# Altium project EL.UPSM.T01.PrjPcb
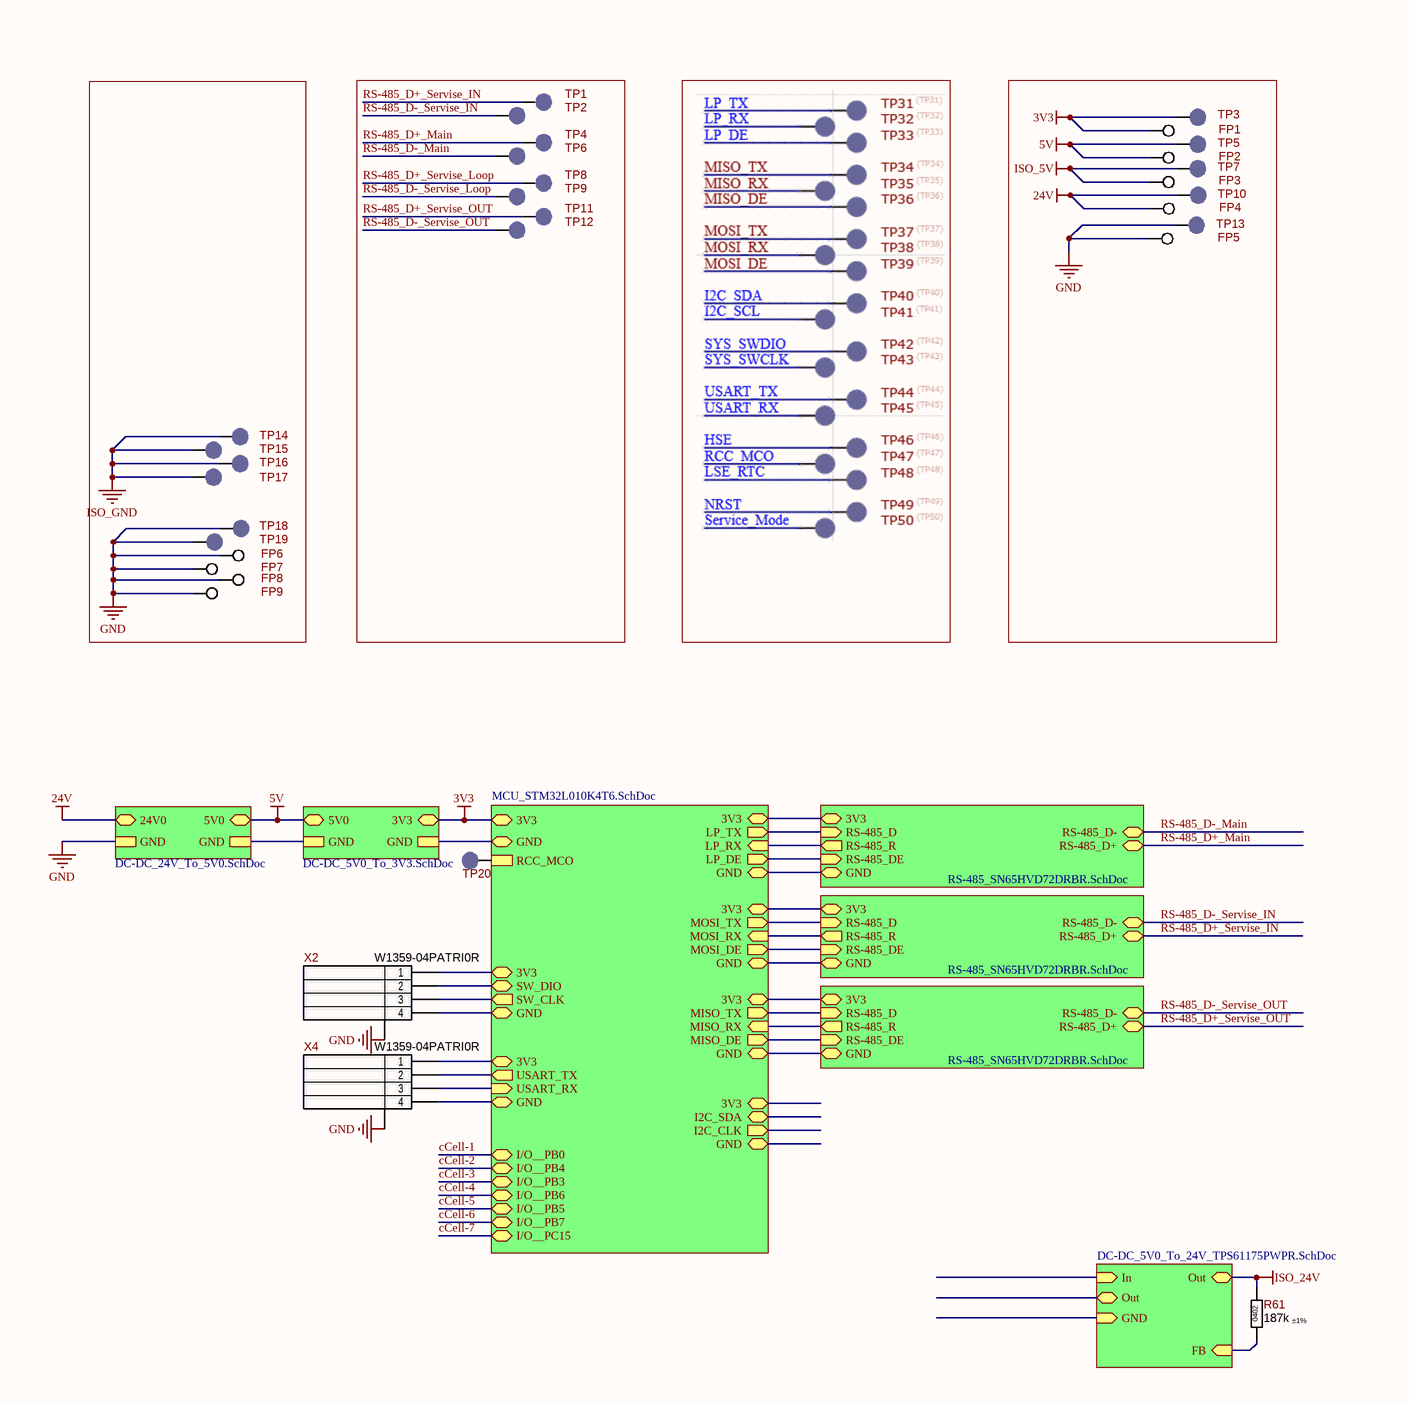
[diagram p0: UPS_Module.SchDoc, left]
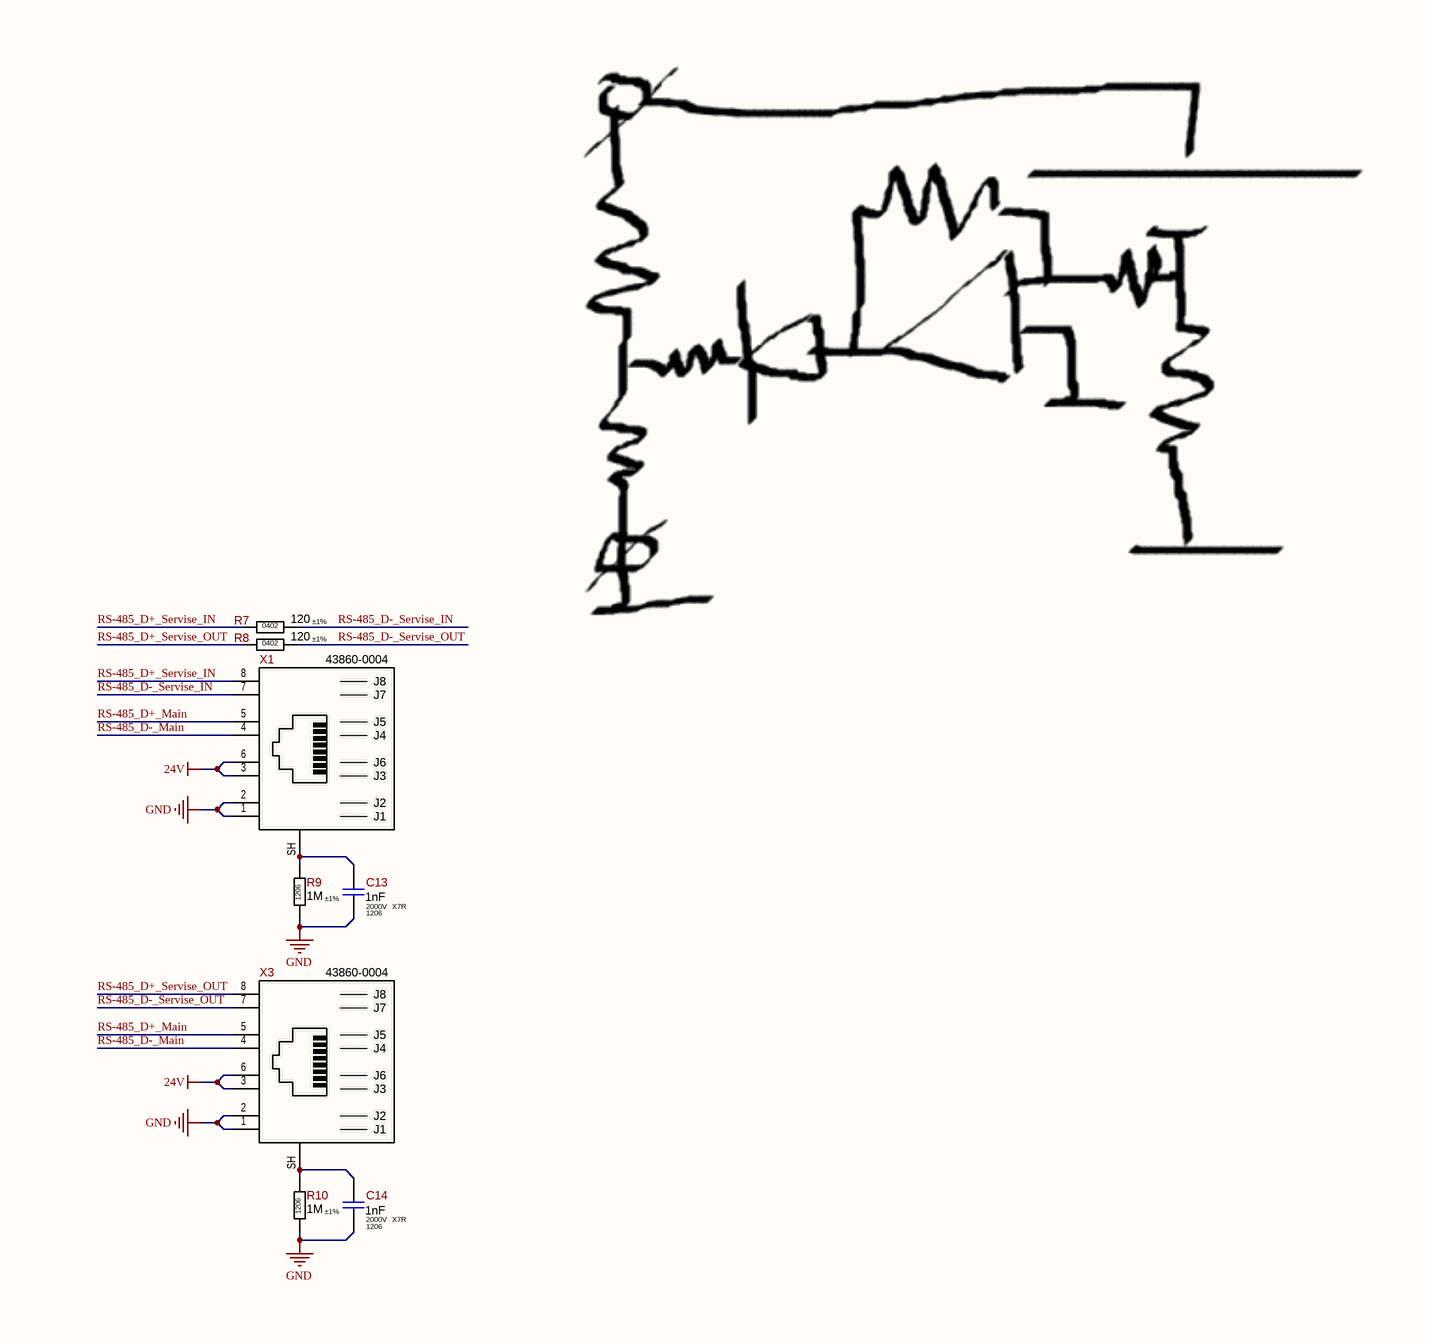
[diagram p1: UPS_Module.SchDoc, right]
1 sheet, 40 parts. Net scope: hierarchical (ports join the sheet entries above them; power ports are global).
Board file: UPS_Module.PcbDoc

## Sheet UPS_Module.SchDoc
size A3; SheetNumber: 11; SheetTotal: 15

### Parts
C13  Package: 1206  Voltage: 2000V  Dielectric Type: X7R  [CAP-1206(3216)X125T20]  (hidden comment: 1nF)
C14  Package: 1206  Voltage: 2000V  Dielectric Type: X7R  [CAP-1206(3216)X125T20]  (hidden comment: 1nF)
FP1  PAD-1.1mm  [PAD-1.1mm]  (value not drawn)  (no BOM)
FP2  PAD-1.1mm  [PAD-1.1mm]  (value not drawn)  (no BOM)
FP3  PAD-1.1mm  [PAD-1.1mm]  (value not drawn)  (no BOM)
FP4  PAD-1.1mm  [PAD-1.1mm]  (value not drawn)  (no BOM)
FP5  PAD-1.1mm  [PAD-1.1mm]  (value not drawn)  (no BOM)
FP6  PAD-1.1mm  [PAD-1.1mm]  (value not drawn)  (no BOM)
FP7  PAD-1.1mm  [PAD-1.1mm]  (value not drawn)  (no BOM)
FP8  PAD-1.1mm  [PAD-1.1mm]  (value not drawn)  (no BOM)
FP9  PAD-1.1mm  [PAD-1.1mm]  (value not drawn)  (no BOM)
R7  Tolerance: ±1%  Package: 0402  [R_ANY_CHIP_0402_HI]  (hidden comment: 120)
R8  Tolerance: ±1%  Package: 0402  [R_ANY_CHIP_0402_HI]  (hidden comment: 120)
R9  Tolerance: ±1%  Package: 1206  [CHV1206-Series]  (hidden comment: 1M)
R10  Tolerance: ±1%  Package: 1206  [CHV1206-Series]  (hidden comment: 1M)
R61  Tolerance: ±1%  Package: 0402  [R_ANY_CHIP_0402_MED]  (hidden comment: 187k)
TP1  LED_LINK  [TP_SMD_2mm]  (value not drawn)  (no BOM)
TP2  LED_LINK  [TP_SMD_2mm]  (value not drawn)  (no BOM)
TP3  LED_LINK  [TP_SMD_2mm]  (value not drawn)  (no BOM)
TP4  LED_LINK  [TP_SMD_2mm]  (value not drawn)  (no BOM)
TP5  LED_LINK  [TP_SMD_2mm]  (value not drawn)  (no BOM)
TP6  LED_LINK  [TP_SMD_2mm]  (value not drawn)  (no BOM)
TP7  LED_LINK  [TP_SMD_2mm]  (value not drawn)  (no BOM)
TP8  LED_LINK  [TP_SMD_2mm]  (value not drawn)  (no BOM)
TP9  LED_LINK  [TP_SMD_2mm]  (value not drawn)  (no BOM)
TP10  LED_LINK  [TP_SMD_2mm]  (value not drawn)  (no BOM)
TP11  LED_LINK  [TP_SMD_2mm]  (value not drawn)  (no BOM)
TP12  LED_LINK  [TP_SMD_2mm]  (value not drawn)  (no BOM)
TP13  LED_LINK  [TP_SMD_2mm]  (value not drawn)  (no BOM)
TP14  LED_LINK  [TP_SMD_2mm]  (value not drawn)  (no BOM)
TP15  LED_LINK  [TP_SMD_2mm]  (value not drawn)  (no BOM)
TP16  LED_LINK  [TP_SMD_2mm]  (value not drawn)  (no BOM)
TP17  LED_LINK  [TP_SMD_2mm]  (value not drawn)  (no BOM)
TP18  LED_LINK  [TP_SMD_2mm]  (value not drawn)  (no BOM)
TP19  LED_LINK  [TP_SMD_2mm]  (value not drawn)  (no BOM)
TP20  LED_LINK  [TP_SMD_2mm]  (value not drawn)  (no BOM)
X1  43860-0004  [43860-0004]
X2  W1359-04PATRI0R  [W1359-04PATXI0R_DBG]
X3  43860-0004  [43860-0004]
X4  W1359-04PATRI0R  [W1359-04PATXI0R_DBG]

### Sub-sheets
ISO_I2C = DC-DC_5V0_To_24V_TPS61175PWPR.SchDoc (file not in this document): Out (bidir), In (in), GND (in), Out (bidir), FB (in)
LDO_3V3 = DC-DC_5V0_To_3V3.SchDoc (file not in this document): 3V3 (bidir), 5V0 (bidir), GND, GND
LDO_3V3 = DC-DC_24V_To_5V0.SchDoc (file not in this document): 5V0 (bidir), 24V0 (bidir), GND, GND
MCU = MCU_STM32L010K4T6.SchDoc (file not in this document): LP_TX (out), LP_RX (in), LP_DE (out), MISO_TX (out), MISO_RX (in), MISO_DE (out), MOSI_RX (in), MOSI_TX (out), MOSI_DE (out), I2C_SDA (bidir), I2C_CLK (out), SW_DIO (bidir), SW_CLK (out), USART_TX (out), USART_RX (in), RCC_MCO, I/O__PB0 (bidir), I/O__PB3 (bidir), I/O__PB4 (bidir), I/O__PB5 (bidir), I/O__PB6 (bidir), I/O__PB7 (bidir), I/O__PC15 (bidir), 3V3 (bidir), 3V3 (bidir), 3V3 (bidir), 3V3 (bidir), 3V3 (bidir), GND (bidir), GND (bidir), GND (bidir), GND (bidir), GND (bidir), GND (bidir), GND (bidir), 3V3 (bidir), 3V3 (bidir)
RS-485 = RS-485_SN65HVD72DRBR.SchDoc (file not in this document): 3V3 (bidir), RS-485_D+ (bidir), RS-485_D- (bidir), RS-485_R (out), RS-485_D (in), RS-485_DE (in), GND (bidir)
RS-485 = RS-485_SN65HVD72DRBR.SchDoc (file not in this document): 3V3 (bidir), RS-485_D+ (bidir), RS-485_D- (bidir), RS-485_R (out), RS-485_D (in), RS-485_DE (in), GND (bidir)
RS-485 = RS-485_SN65HVD72DRBR.SchDoc (file not in this document): 3V3 (bidir), RS-485_D+ (bidir), RS-485_D- (bidir), RS-485_R (out), RS-485_D (in), RS-485_DE (in), GND (bidir)

### Nets
3V3: FP1.1 TP3.1 ; sheet LDO_3V3/3V3, sheet MCU/3V3
5V: FP2.1 TP5.1 ; sheet LDO_3V3/5V0, sheet LDO_3V3/5V0
24V: FP4.1 TP10.1 X1.3(TD3-) X1.6(CT) X3.3(TD3-) X3.6(CT) ; sheet LDO_3V3/24V0
GND: C13.2 C14.2 FP5.1 FP6.1 FP7.1 FP8.1 FP9.1 R9.2 R10.2 TP13.1 TP18.1 TP19.1 X1.1(TD4-) X1.2(TD4+) X2.MP(MountPad) X3.1(TD4-) X3.2(TD4+) X4.MP(MountPad) ; sheet LDO_3V3/GND
ISO_5V: FP3.1 TP7.1
ISO_24V: R61.1 ; sheet ISO_I2C/Out
ISO_GND: TP14.1 TP15.1 TP16.1 TP17.1
cCell-1: sheet MCU/I/O__PB0
cCell-2: sheet MCU/I/O__PB4
cCell-3: sheet MCU/I/O__PB3
cCell-4: sheet MCU/I/O__PB6
cCell-5: sheet MCU/I/O__PB5
cCell-6: sheet MCU/I/O__PB7
cCell-7: sheet MCU/I/O__PC15
RS-485_D+_Main: TP4.1 X1.5(CT) X3.5(CT) ; sheet RS-485/RS-485_D+
RS-485_D+_Servise_IN: R7.1 TP1.1 X1.8(TD2+) ; sheet RS-485/RS-485_D+
RS-485_D+_Servise_Loop: TP8.1
RS-485_D+_Servise_OUT: R8.1 TP11.1 X3.8(TD2+) ; sheet RS-485/RS-485_D+
RS-485_D-_Main: TP6.1 X1.4(TD3+) X3.4(TD3+) ; sheet RS-485/RS-485_D-
RS-485_D-_Servise_IN: R7.2 TP2.1 X1.7(TD2-) ; sheet RS-485/RS-485_D-
RS-485_D-_Servise_Loop: TP9.1
RS-485_D-_Servise_OUT: R8.2 TP12.1 X3.7(TD2-) ; sheet RS-485/RS-485_D-
NetC13_1: C13.1 R9.1 X1.SH(Shield)
NetC14_1: C14.1 R10.1 X3.SH(Shield)
NetR61_2: R61.2 ; sheet ISO_I2C/FB
NetTP20_1: TP20.1 ; sheet MCU/RCC_MCO
NetX2_1: X2.1 ; sheet MCU/3V3
NetX2_2: X2.2 ; sheet MCU/SW_DIO
NetX2_3: X2.3 ; sheet MCU/SW_CLK
NetX2_4: X2.4 ; sheet MCU/GND
NetX4_1: X4.1 ; sheet MCU/3V3
NetX4_2: X4.2 ; sheet MCU/USART_TX
NetX4_3: X4.3 ; sheet MCU/USART_RX
NetX4_4: X4.4 ; sheet MCU/GND
(unnamed): sheet LDO_3V3/GND, sheet MCU/GND
(unnamed): sheet LDO_3V3/GND, sheet LDO_3V3/GND
(unnamed): sheet MCU/LP_TX, sheet RS-485/RS-485_D
(unnamed): sheet MCU/LP_RX, sheet RS-485/RS-485_R
(unnamed): sheet MCU/LP_DE, sheet RS-485/RS-485_DE
(unnamed): sheet MCU/MISO_TX, sheet RS-485/RS-485_D
(unnamed): sheet MCU/MISO_RX, sheet RS-485/RS-485_R
(unnamed): sheet MCU/MISO_DE, sheet RS-485/RS-485_DE
(unnamed): sheet MCU/MOSI_RX, sheet RS-485/RS-485_R
(unnamed): sheet MCU/MOSI_TX, sheet RS-485/RS-485_D
(unnamed): sheet MCU/MOSI_DE, sheet RS-485/RS-485_DE
(unnamed): sheet MCU/3V3, sheet RS-485/3V3
(unnamed): sheet MCU/3V3, sheet RS-485/3V3
(unnamed): sheet MCU/GND, sheet RS-485/GND
(unnamed): sheet MCU/GND, sheet RS-485/GND
(unnamed): sheet MCU/GND, sheet RS-485/GND
(unnamed): sheet MCU/3V3, sheet RS-485/3V3

### Notes on the sheet
- (in symbol 43860-0004) J8; J7; J5; J4; J6; J3; J2; J1

### Library data of the parts
C13 C14 = Capacitor-NonPolar: 1nF 2000V X7R ±10% 1206 Ceramic Capacitor RoHS; Part Number: CC1206KKX7RDBB102; Manufacturer: Yageo; Replacement: NONE; Value: 1nF; Part Type: Ceramic / X7R / 1206; Component Type: SMD; Temperature Range: -55°C ~ 125°C; Tolerance: ±10%; ComponentLink1URL: https://www.yageo.com/upload/media/product/products/datasheet/mlcc/UPY-NP0X7R_HV_1KV-to-3KV_11.pdf; Supplier 1: Digi-Key; Supplier Part Number 1: 311-1487-2-ND; ComponentLink1Description: Datasheet
FP1-FP9 = Pad: 1.1mm Pad for Plug-In or Receptacle; Manufacturer: NONE; Component Status: Released; Part Number: PAD-1.1mm; Component Type: PTH; Part Type: Pad; Temperature Range: NONE; ComponentLink1URL: NONE; Replacement: NONE; ComponentLink1Description: Datasheet; Price: NONE
R7 R8 = Resistor: 120 Ohms ±1% 1/16W 0402 Thick Film Resistor; Part Number: RC0402FR-07120RL; Manufacturer: Yageo; Power Rating: 0.062W; Voltage: 50V; Component Status: Released; Temperature Stability: ±100ppm/°C; Replacement: NONE; Value: 120; Component Type: SMD; Part Type: Thick Film; Temperature Range: -55°C ~ 155°C; ComponentLink1URL: https://eu.mouser.com/datasheet/2/447/PYu_RC_Group_51_RoHS_L_10-1664068.pdf; Price: 0.00065; ComponentLink1Description: Datasheet
R9 R10 = Resistor: 1 MOhms ±1%, 1/4W 1206 Thick Film Resistor; Part Number: CHV1206-FX-1004ELF; Manufacturer: Bourns; Power Rating: 0.25W; Voltage: 800V; Component Status: Released; Temperature Stability: ±100ppm/°C; Replacement: NONE; Value: 1M; Component Type: SMD; Part Type: Thick Film; Temperature Range: -55°C ~ 155°C; ComponentLink1URL: https://eu.mouser.com/datasheet/2/54/CHV-777595.pdf; Supplier 1: Mouser; Supplier Part Number 1: 652-CHV1206FX1004ELF; Price: 0.0173216; ComponentLink1Description: Datasheet
R61 = Resistor: 187 kOhms ±1% 1/16W 0402 Thick Film Resistor; Part Number: RC0402FR-07187KL; Manufacturer: Yageo; Power Rating: 0.062W; Voltage: 50V; Component Status: Released; Temperature Stability: ±100ppm/°C; Replacement: NONE; Value: 187k; Component Type: SMD; Part Type: Thick Film; Temperature Range: -55°C ~ 155°C; ComponentLink1URL: https://eu.mouser.com/datasheet/2/447/YAGEO_PYu_RC_Group_51_RoHS_L_12-3313492.pdf; Supplier 1: Digi-Key; Supplier Part Number 1: 311-187KLRTR-ND; Price: NONE; ComponentLink1Description: Datasheet
TP1-TP20 = Test-Point-SMD-1: Test Point SMD Pad 1.0mm/1.5mm/2mm; Part Number: TP-PAD-SMD; Replacement: NONE; Part Type: Test Point; Component Type: SMD; Temperature Range: NONE; ComponentLink1URL: NONE; ComponentLink1Description: Datasheet
X1 X3 = 43860-0004: RJ45 8P8C Shielded Cat 3 10 Base-T Connector; Manufacturer: Molex; Component Status: Released; Replacement: NONE; Part Number: 43860-0004; Part Type: RJ-45; Component Type: PTH; Temperature Range: -40°C ~ 85°C; ComponentLink1URL: https://www.molex.com/pdm_docs/sd/438600004_sd.pdf; Supplier 1: Mouser; Supplier Part Number 1: 538-43860-0004; Price: 2.1435; ComponentLink1Description: Datasheet
X2 X4 = General-4-Pin-MP: 1.25mm Wire-to-Board Header, Vertical, SMT, 4 pin; Manufacturer: Hsuan Mao Technology; Component Status: Released; Replacement: 53398-0471; Part Number: W1359-04PATRI0R; Part Type: Wire-to-Board / 1.25mm; Component Type: SMD; Temperature Range: -40°C ~ 85°C; Price: 0.06